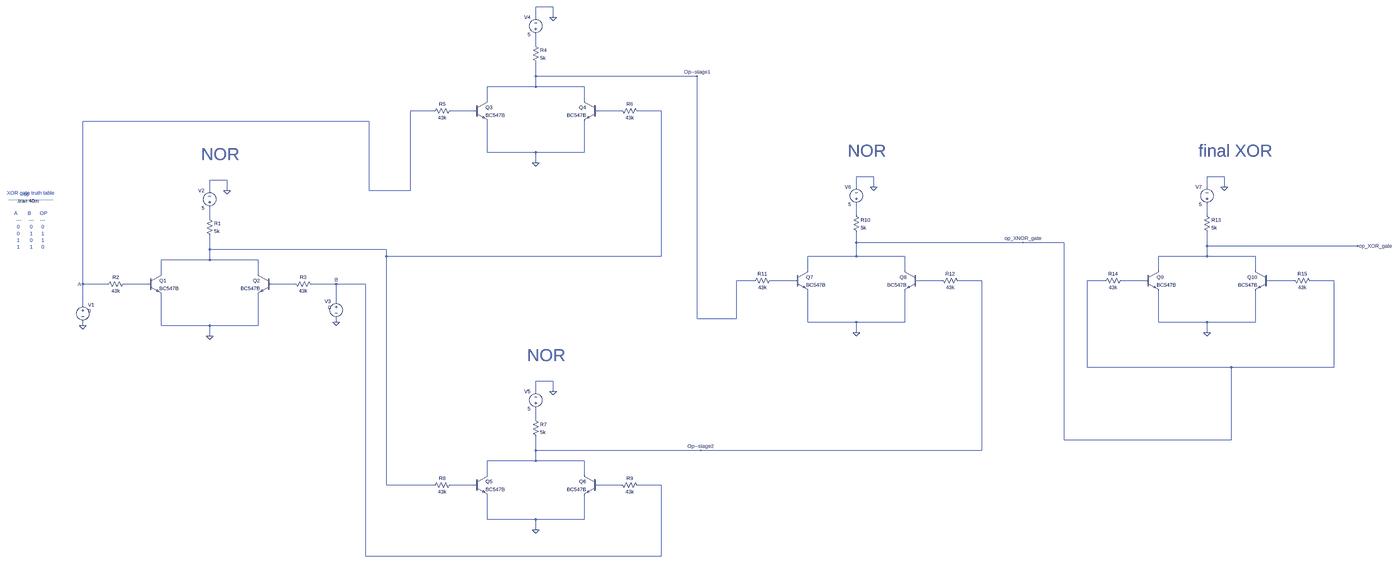
[diagram p0: schematic XOR_using_NOR_gate.asc, whole sheet]
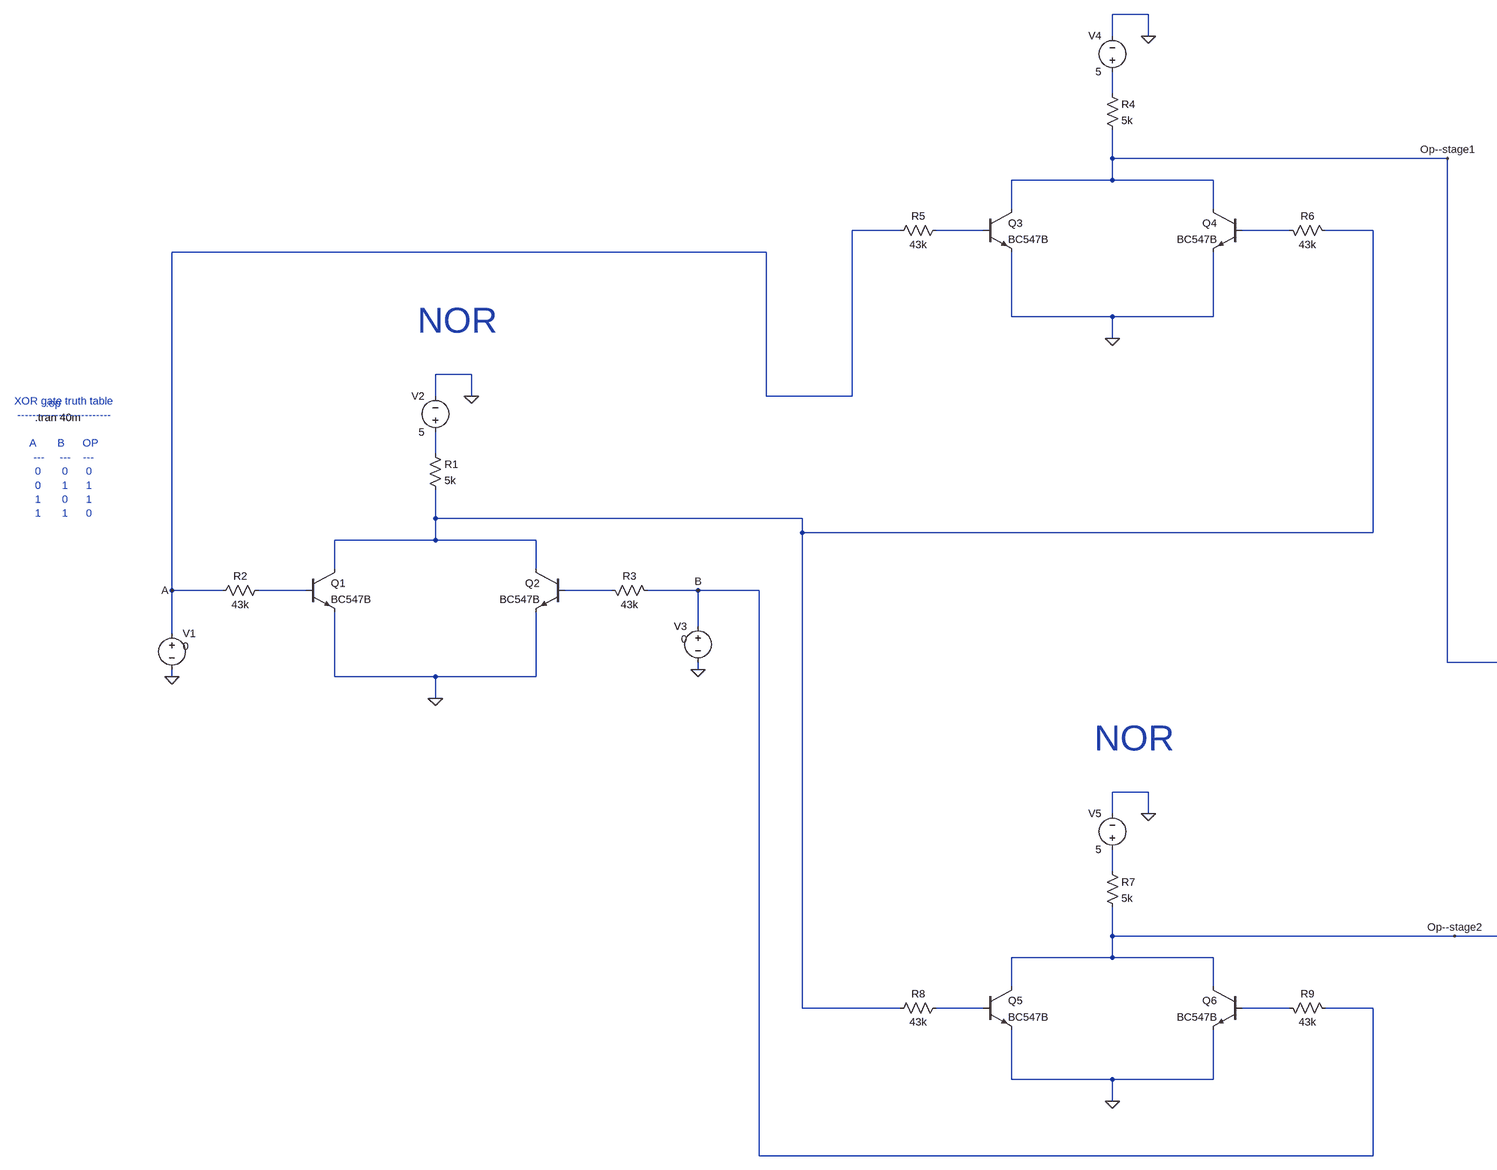
[diagram p1: schematic XOR_using_NOR_gate.asc, part, row 1 of 1, column 1 of 2]
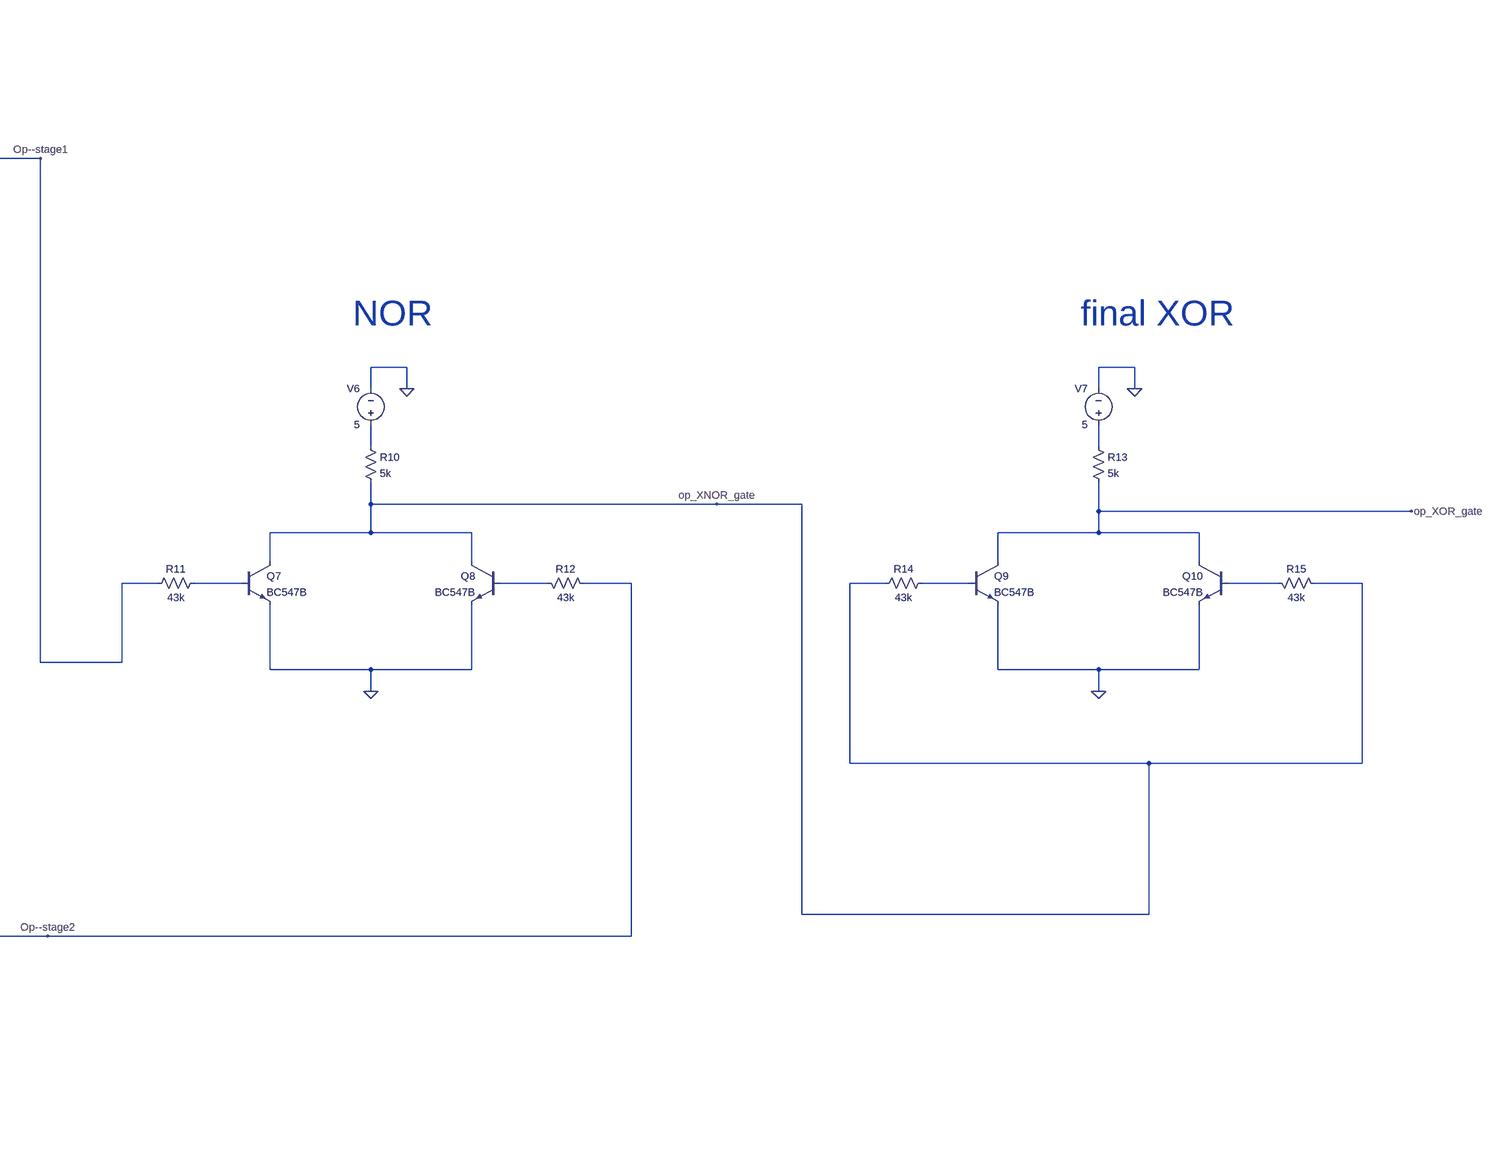
[diagram p2: schematic XOR_using_NOR_gate.asc, part, row 1 of 1, column 2 of 2]
XOR_using_NOR_gate.asc, the LTspice schematic file:
Version 4.1
SHEET 1 7044 1876
WIRE 2064 -816 1984 -816
WIRE 1984 -768 1984 -816
WIRE 2064 -768 2064 -816
WIRE 1984 -640 1984 -688
WIRE 1984 -496 1984 -560
WIRE 2800 -496 1984 -496
WIRE 1984 -448 1984 -496
WIRE 1984 -448 1760 -448
WIRE 2208 -448 1984 -448
WIRE 1760 -384 1760 -448
WIRE 2208 -384 2208 -448
WIRE 1504 -336 1344 -336
WIRE 1696 -336 1584 -336
WIRE 2384 -336 2272 -336
WIRE 2576 -336 2464 -336
WIRE 848 -288 -496 -288
WIRE 1760 -144 1760 -288
WIRE 1984 -144 1760 -144
WIRE 2208 -144 2208 -288
WIRE 2208 -144 1984 -144
WIRE 1984 -96 1984 -144
WIRE 3648 -32 3568 -32
WIRE 6016 -32 5936 -32
WIRE 176 -16 96 -16
WIRE 3568 16 3568 -32
WIRE 3648 16 3648 -32
WIRE 5936 16 5936 -32
WIRE 6016 16 6016 -32
WIRE 96 32 96 -16
WIRE 176 32 176 -16
WIRE 848 32 848 -288
WIRE 1344 32 1344 -336
WIRE 1344 32 848 32
WIRE 3568 144 3568 96
WIRE 5936 144 5936 96
WIRE 96 160 96 112
WIRE 3568 272 3568 224
WIRE 4752 272 3568 272
WIRE 5200 272 4752 272
WIRE 5936 288 5936 224
WIRE 6848 288 5936 288
WIRE 96 304 96 240
WIRE 928 304 96 304
WIRE 928 336 928 304
WIRE 2576 336 2576 -336
WIRE 2576 336 928 336
WIRE 3568 336 3568 272
WIRE 3568 336 3344 336
WIRE 3792 336 3568 336
WIRE 5936 336 5936 288
WIRE 5936 336 5712 336
WIRE 6160 336 5936 336
WIRE 96 352 96 304
WIRE 96 352 -128 352
WIRE 320 352 96 352
WIRE 3344 400 3344 336
WIRE 3792 400 3792 336
WIRE 5712 400 5712 336
WIRE 6160 400 6160 336
WIRE -128 416 -128 352
WIRE 320 416 320 352
WIRE 3088 448 3008 448
WIRE 3280 448 3168 448
WIRE 3968 448 3856 448
WIRE 4304 448 4048 448
WIRE 5456 448 5376 448
WIRE 5648 448 5536 448
WIRE 6336 448 6224 448
WIRE 6672 448 6416 448
WIRE -496 464 -496 -288
WIRE -384 464 -496 464
WIRE -192 464 -304 464
WIRE 496 464 384 464
WIRE 688 464 576 464
WIRE 832 464 688 464
WIRE 688 544 688 464
WIRE -496 560 -496 464
WIRE 2800 624 2800 -496
WIRE 3008 624 3008 448
WIRE 3008 624 2800 624
WIRE 688 640 688 624
WIRE 3344 640 3344 496
WIRE 3568 640 3344 640
WIRE 3792 640 3792 496
WIRE 3792 640 3568 640
WIRE 5712 640 5712 496
WIRE 5936 640 5712 640
WIRE 6160 640 6160 496
WIRE 6160 640 5936 640
WIRE -496 656 -496 640
WIRE -128 656 -128 512
WIRE 96 656 -128 656
WIRE 320 656 320 512
WIRE 320 656 96 656
WIRE 3568 688 3568 640
WIRE 5936 688 5936 640
WIRE 96 704 96 656
WIRE 5376 848 5376 448
WIRE 6048 848 5376 848
WIRE 6672 848 6672 448
WIRE 6672 848 6048 848
WIRE 2064 912 1984 912
WIRE 1984 960 1984 912
WIRE 2064 960 2064 912
WIRE 1984 1088 1984 1040
WIRE 5200 1184 5200 272
WIRE 6048 1184 6048 848
WIRE 6048 1184 5200 1184
WIRE 1984 1232 1984 1168
WIRE 2816 1232 1984 1232
WIRE 4304 1232 4304 448
WIRE 4304 1232 2816 1232
WIRE 1984 1280 1984 1232
WIRE 1984 1280 1760 1280
WIRE 2208 1280 1984 1280
WIRE 1760 1344 1760 1280
WIRE 2208 1344 2208 1280
WIRE 928 1392 928 336
WIRE 1504 1392 928 1392
WIRE 1696 1392 1584 1392
WIRE 2384 1392 2272 1392
WIRE 2576 1392 2464 1392
WIRE 1760 1584 1760 1440
WIRE 1984 1584 1760 1584
WIRE 2208 1584 2208 1440
WIRE 2208 1584 1984 1584
WIRE 1984 1632 1984 1584
WIRE 832 1872 832 464
WIRE 2576 1872 2576 1392
WIRE 2576 1872 832 1872
FLAG -496 464 A
FLAG -496 656 0
FLAG 688 464 B
FLAG 96 704 0
FLAG 176 32 0
FLAG 688 640 0
FLAG 1984 -96 0
FLAG 2064 -768 0
FLAG 2800 -496 Op--stage1
FLAG 1984 1632 0
FLAG 2064 960 0
FLAG 2816 1232 Op--stage2
FLAG 3568 688 0
FLAG 3648 16 0
FLAG 4752 272 op_XNOR_gate
FLAG 5936 688 0
FLAG 6016 16 0
FLAG 6848 288 op_XOR_gate
SYMBOL voltage -496 544 R0
WINDOW 3 24 44 Left 2
WINDOW 123 0 0 Left 0
WINDOW 39 0 0 Left 0
SYMATTR Value 0
SYMATTR InstName V1
SYMBOL npn -192 416 R0
SYMATTR InstName Q1
SYMATTR Value BC547B
SYMBOL voltage 96 128 R180
WINDOW 0 24 96 Left 2
WINDOW 3 24 16 Left 2
WINDOW 123 0 0 Left 0
WINDOW 39 0 0 Left 0
SYMATTR InstName V2
SYMATTR Value 5
SYMBOL res 80 144 R0
SYMATTR InstName R1
SYMATTR Value 5k
SYMBOL res -288 448 R90
WINDOW 0 0 56 VBottom 2
WINDOW 3 32 56 VTop 2
SYMATTR InstName R2
SYMATTR Value 43k
SYMBOL npn 384 416 M0
SYMATTR InstName Q2
SYMATTR Value BC547B
SYMBOL res 480 448 M90
WINDOW 0 0 56 VBottom 2
WINDOW 3 32 56 VTop 2
SYMATTR InstName R3
SYMATTR Value 43k
SYMBOL voltage 688 528 M0
WINDOW 3 24 44 Left 2
WINDOW 123 0 0 Left 0
WINDOW 39 0 0 Left 0
SYMATTR Value 0
SYMATTR InstName V3
SYMBOL npn 1696 -384 R0
SYMATTR InstName Q3
SYMATTR Value BC547B
SYMBOL voltage 1984 -672 R180
WINDOW 0 24 96 Left 2
WINDOW 3 24 16 Left 2
WINDOW 123 0 0 Left 0
WINDOW 39 0 0 Left 0
SYMATTR InstName V4
SYMATTR Value 5
SYMBOL res 1968 -656 R0
SYMATTR InstName R4
SYMATTR Value 5k
SYMBOL res 1600 -352 R90
WINDOW 0 0 56 VBottom 2
WINDOW 3 32 56 VTop 2
SYMATTR InstName R5
SYMATTR Value 43k
SYMBOL npn 2272 -384 M0
SYMATTR InstName Q4
SYMATTR Value BC547B
SYMBOL res 2368 -352 M90
WINDOW 0 0 56 VBottom 2
WINDOW 3 32 56 VTop 2
SYMATTR InstName R6
SYMATTR Value 43k
SYMBOL npn 1696 1344 R0
SYMATTR InstName Q5
SYMATTR Value BC547B
SYMBOL voltage 1984 1056 R180
WINDOW 0 24 96 Left 2
WINDOW 3 24 16 Left 2
WINDOW 123 0 0 Left 0
WINDOW 39 0 0 Left 0
SYMATTR InstName V5
SYMATTR Value 5
SYMBOL res 1968 1072 R0
SYMATTR InstName R7
SYMATTR Value 5k
SYMBOL res 1600 1376 R90
WINDOW 0 0 56 VBottom 2
WINDOW 3 32 56 VTop 2
SYMATTR InstName R8
SYMATTR Value 43k
SYMBOL npn 2272 1344 M0
SYMATTR InstName Q6
SYMATTR Value BC547B
SYMBOL res 2368 1376 M90
WINDOW 0 0 56 VBottom 2
WINDOW 3 32 56 VTop 2
SYMATTR InstName R9
SYMATTR Value 43k
SYMBOL npn 3280 400 R0
SYMATTR InstName Q7
SYMATTR Value BC547B
SYMBOL voltage 3568 112 R180
WINDOW 0 24 96 Left 2
WINDOW 3 24 16 Left 2
WINDOW 123 0 0 Left 0
WINDOW 39 0 0 Left 0
SYMATTR InstName V6
SYMATTR Value 5
SYMBOL res 3552 128 R0
SYMATTR InstName R10
SYMATTR Value 5k
SYMBOL res 3184 432 R90
WINDOW 0 0 56 VBottom 2
WINDOW 3 32 56 VTop 2
SYMATTR InstName R11
SYMATTR Value 43k
SYMBOL npn 3856 400 M0
SYMATTR InstName Q8
SYMATTR Value BC547B
SYMBOL res 3952 432 M90
WINDOW 0 0 56 VBottom 2
WINDOW 3 32 56 VTop 2
SYMATTR InstName R12
SYMATTR Value 43k
SYMBOL npn 5648 400 R0
SYMATTR InstName Q9
SYMATTR Value BC547B
SYMBOL voltage 5936 112 R180
WINDOW 0 24 96 Left 2
WINDOW 3 24 16 Left 2
WINDOW 123 0 0 Left 0
WINDOW 39 0 0 Left 0
SYMATTR InstName V7
SYMATTR Value 5
SYMBOL res 5920 128 R0
SYMATTR InstName R13
SYMATTR Value 5k
SYMBOL res 5552 432 R90
WINDOW 0 0 56 VBottom 2
WINDOW 3 32 56 VTop 2
SYMATTR InstName R14
SYMATTR Value 43k
SYMBOL npn 6224 400 M0
SYMATTR InstName Q10
SYMATTR Value BC547B
SYMBOL res 6320 432 M90
WINDOW 0 0 56 VBottom 2
WINDOW 3 32 56 VTop 2
SYMATTR InstName R15
SYMATTR Value 43k
TEXT -800 80 Left 2 !.tran 40m
TEXT -776 48 Left 2 ;.op
TEXT -736 168 Center 2 ;XOR gate truth table\n-------------------------\n \nA       B      OP\n---     ---    ---\n0       0      0\n0       1      1\n1       0      1\n1       1      0
TEXT 56 -136 Left 6 ;NOR
TEXT 1944 792 Left 6 ;NOR
TEXT 3528 -152 Left 6 ;NOR
TEXT 5896 -152 Left 6 ;final XOR

The netlist it stands for:
* XOR_using_NOR_gate.asc
V1 A 0 0
Q1 N004 N012 0 0 BC547B
V2 N007 0 5
R1 N007 N004 5k
R2 N012 A 43k
Q2 N004 N013 0 0 BC547B
R3 N013 B 43k
V3 B 0 0
Q3 Op--stage1 N002 0 0 BC547B
V4 N001 0 5
R4 N001 Op--stage1 5k
R5 N002 A 43k
Q4 Op--stage1 N003 0 0 BC547B
R6 N003 N004 43k
Q5 Op--stage2 N015 0 0 BC547B
V5 N014 0 5
R7 N014 Op--stage2 5k
R8 N015 N004 43k
Q6 Op--stage2 N016 0 0 BC547B
R9 N016 B 43k
Q7 op_XNOR_gate N008 0 0 BC547B
V6 N005 0 5
R10 N005 op_XNOR_gate 5k
R11 N008 Op--stage1 43k
Q8 op_XNOR_gate N009 0 0 BC547B
R12 N009 Op--stage2 43k
Q9 op_XOR_gate N010 0 0 BC547B
V7 N006 0 5
R13 N006 op_XOR_gate 5k
R14 N010 op_XNOR_gate 43k
Q10 op_XOR_gate N011 0 0 BC547B
R15 N011 op_XNOR_gate 43k
.model NPN NPN
.model PNP PNP
.lib standard.bjt
.tran 40m
* .op
* XOR gate truth table
* -------------------------
* A       B      OP
* ---     ---    ---
* 0       0      0
* 0       1      1
* 1       0      1
* 1       1      0
* NOR
* NOR
* NOR
* final XOR
.backanno
.end